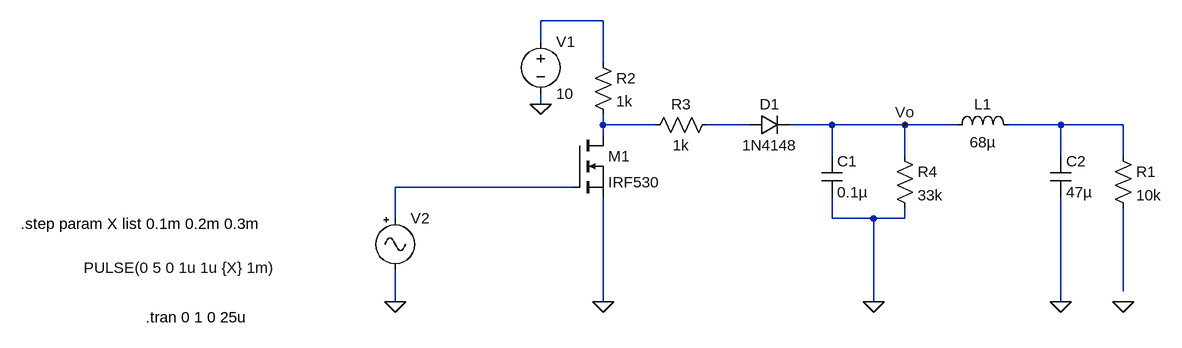
[diagram p0: schematic ArduinoToDriver.asc]
ArduinoToDriver.asc, the LTspice schematic file:
Version 4
SHEET 1 1108 680
WIRE 240 -96 144 -96
WIRE 144 -64 144 -96
WIRE 240 -32 240 -96
WIRE 144 32 144 16
WIRE 240 64 240 48
WIRE 320 64 240 64
WIRE 464 64 400 64
WIRE 592 64 528 64
WIRE 704 64 592 64
WIRE 784 64 704 64
WIRE 944 64 864 64
WIRE 1040 64 944 64
WIRE 240 80 240 64
WIRE 592 112 592 64
WIRE 704 112 704 64
WIRE 944 112 944 64
WIRE 1040 112 1040 64
WIRE 192 160 -80 160
WIRE -80 208 -80 160
WIRE 592 208 592 176
WIRE 656 208 592 208
WIRE 704 208 704 192
WIRE 704 208 656 208
WIRE 1040 320 1040 192
WIRE -80 336 -80 288
WIRE 240 336 240 176
WIRE 656 336 656 208
WIRE 944 336 944 176
FLAG 144 32 0
FLAG 704 64 Vo
FLAG -80 336 0
FLAG 240 336 0
FLAG 656 336 0
FLAG 944 336 0
FLAG 1040 336 0
SYMBOL nmos 192 80 R0
SYMATTR InstName M1
SYMATTR Value IRF530
SYMBOL voltage 144 -80 R0
WINDOW 123 0 0 Left 0
WINDOW 39 0 0 Left 0
SYMATTR InstName V1
SYMATTR Value 10
SYMBOL Misc\\signal -80 192 R0
WINDOW 3 -479 92 Left 2
WINDOW 123 0 0 Left 0
WINDOW 39 0 0 Left 0
SYMATTR Value PULSE(0 5 0 1u 1u {X} 1m)
SYMATTR InstName V2
SYMBOL res 224 -48 R0
SYMATTR InstName R2
SYMATTR Value 1k
SYMBOL res 304 80 R270
WINDOW 0 32 56 VTop 2
WINDOW 3 0 56 VBottom 2
SYMATTR InstName R3
SYMATTR Value 1k
SYMBOL diode 464 80 R270
WINDOW 0 32 32 VTop 2
WINDOW 3 0 32 VBottom 2
SYMATTR InstName D1
SYMATTR Value 1N4148
SYMBOL cap 576 112 R0
SYMATTR InstName C1
SYMATTR Value 0.1µ
SYMBOL res 688 96 R0
SYMATTR InstName R4
SYMATTR Value 33k
SYMBOL ind 768 80 R270
WINDOW 0 32 56 VTop 2
WINDOW 3 5 56 VBottom 2
SYMATTR InstName L1
SYMATTR Value 68µ
SYMBOL cap 928 112 R0
SYMATTR InstName C2
SYMATTR Value 47µ
SYMBOL res 1024 96 R0
SYMATTR InstName R1
SYMATTR Value 10k
TEXT -464 360 Left 2 !.tran 0 1 0 25u
TEXT -656 216 Left 2 !.step param X list 0.1m 0.2m 0.3m

The netlist it stands for:
* ArduinoToDriver.asc
M1 N002 N005 0 0 IRF530
V1 N001 0 10
V2 N005 0 PULSE(0 5 0 1u 1u {X} 1m)
R2 N001 N002 1k
R3 N002 N003 1k
D1 N003 Vo 1N4148
C1 Vo 0 0.1µ
R4 Vo 0 33k
L1 Vo N004 68µ
C2 N004 0 47µ
R1 N004 N006 10k
.model D D
.lib standard.dio
.model NMOS NMOS
.model PMOS PMOS
.lib standard.mos
.tran 0 1 0 25u
.step param X list 0.1m 0.2m 0.3m
.backanno
.end